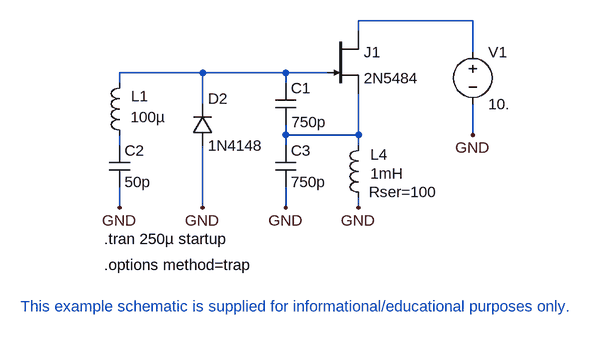
[diagram p0: schematic Clapp.asc]
Clapp.asc, the LTspice schematic file:
Version 4
SHEET 1 2632 2464
WIRE 1952 2048 2080 2048
WIRE 2368 1968 2368 2016
WIRE 2368 2096 2368 2144
WIRE 2192 1984 2192 1968
WIRE 2192 1968 2368 1968
WIRE 2192 2240 2192 2256
WIRE 2192 2160 2192 2144
WIRE 2080 2064 2080 2048
WIRE 2080 2048 2144 2048
WIRE 2080 2128 2080 2144
WIRE 2080 2144 2192 2144
WIRE 2080 2144 2080 2160
WIRE 2080 2224 2080 2256
WIRE 2192 2144 2192 2080
WIRE 1824 2064 1824 2048
WIRE 1824 2048 1952 2048
WIRE 1824 2144 1824 2160
WIRE 1824 2224 1824 2256
WIRE 1952 2096 1952 2048
WIRE 1952 2160 1952 2256
FLAG 2368 2144 GND
FLAG 2192 2256 GND
FLAG 2080 2256 GND
FLAG 1824 2256 GND
FLAG 1952 2256 GND
SYMBOL NJF 2144 1984 R0
SYMATTR InstName J1
SYMATTR Value 2N5484
SYMBOL VOLTAGE 2368 2000 R0
SYMATTR InstName V1
SYMATTR Value 10.
SYMBOL ind 2208 2144 M0
WINDOW 0 -2 30 Right 0
WINDOW 3 -2 59 Right 0
WINDOW 39 0 88 Right 0
SYMATTR InstName L4
SYMATTR Value 1mH
SYMATTR SpiceLine Rser=100
SYMBOL cap 2064 2064 R0
WINDOW 3 25 60 Left 0
SYMATTR InstName C1
SYMATTR Value 750p
SYMBOL cap 1808 2160 R0
SYMATTR InstName C2
SYMATTR Value 50p
SYMBOL cap 2064 2160 R0
SYMATTR InstName C3
SYMATTR Value 750p
SYMBOL ind 1840 2048 M0
WINDOW 0 -2 36 Right 0
WINDOW 3 -1 68 Right 0
SYMATTR InstName L1
SYMATTR Value 100µ
SYMBOL diode 1936 2160 M180
WINDOW 0 24 72 Left 0
WINDOW 3 24 0 Left 0
SYMATTR InstName D2
SYMATTR Value 1N4148
TEXT 1800 2304 Left 0 !.tran 250µ startup
TEXT 1800 2344 Left 0 !.options method=trap
TEXT 1672 2408 Left 0 ;This example schematic is supplied for informational/educational purposes only.

The netlist it stands for:
* Clapp.asc
J1 N002 N001 N003 2N5484
V1 N002 GND 10.
L4 N003 GND 1mH Rser=100
C1 N001 N003 750p
C2 N004 GND 50p
C3 N003 GND 750p
L1 N001 N004 100µ
D2 GND N001 1N4148
.model D D
.lib standard.dio
.model NJF NJF
.model PJF PJF
.lib standard.jft
.tran 250µ startup
.options method=trap
* This example schematic is supplied for informational/educational purposes only.
.backanno
.end